# EAGLE design v2.1 Main (EAGLE 9.7.0)
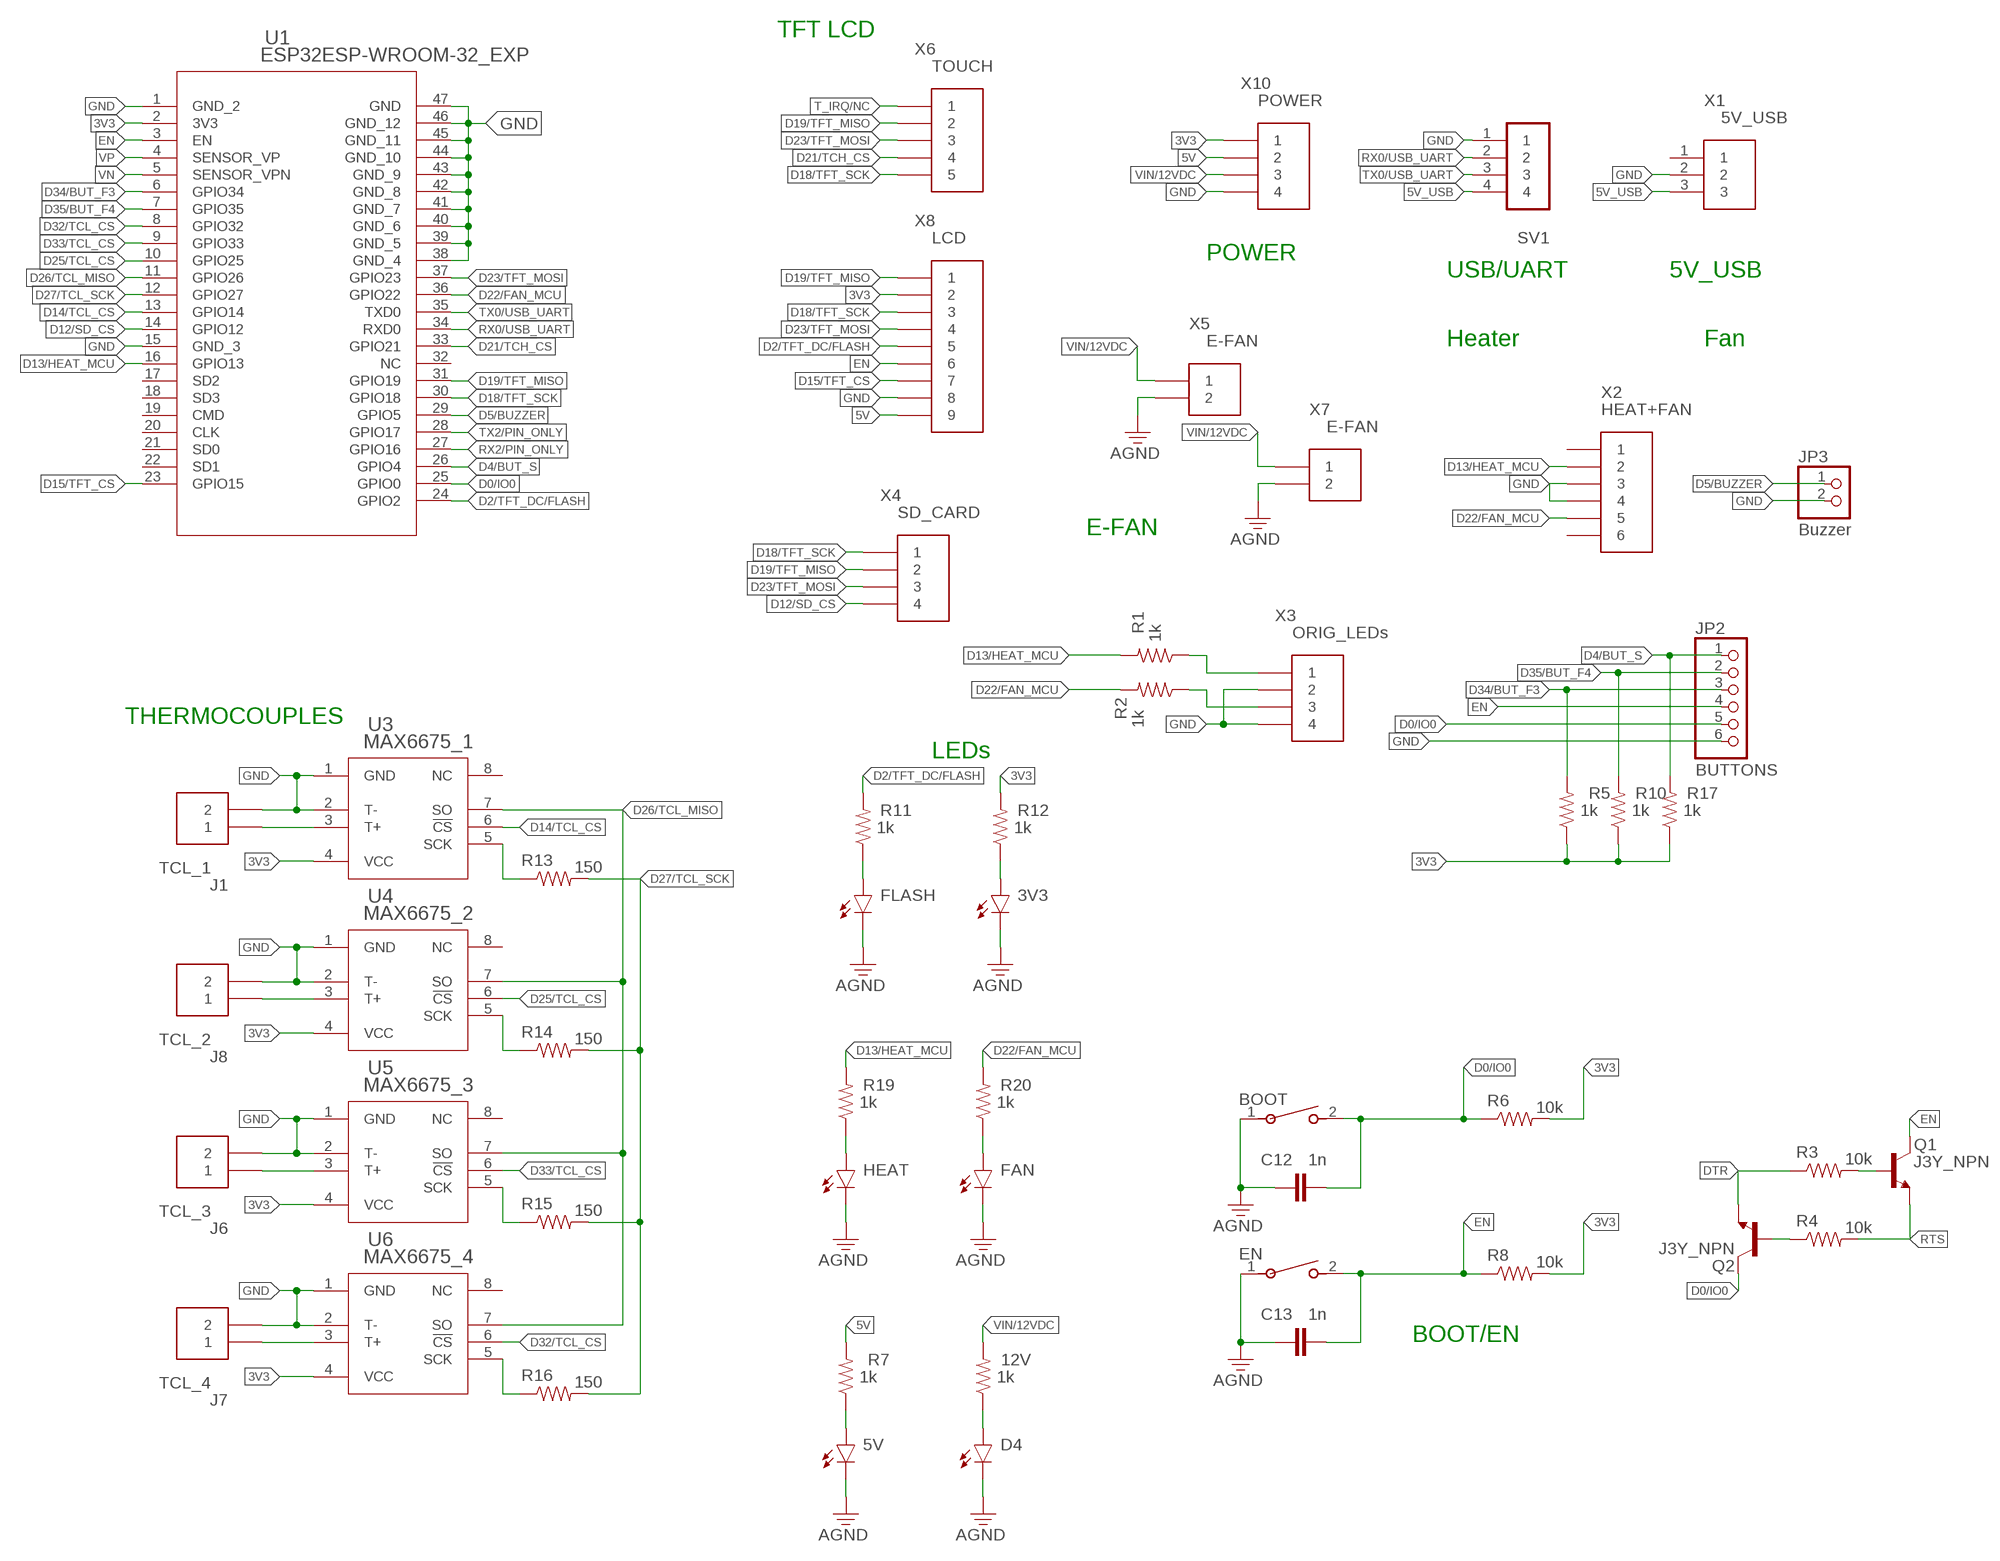
[diagram p0: schematic, sheet 1]

## Parts
3V3  LED  CHIP-FLAT-B_0805  [LEDC2012X110N_FLAT-B]
5V  LED  CHIP-FLAT-B_0805  [LEDC2012X110N_FLAT-B]
12V  1k  R-US_CHIP-0805(2012-METRIC)  [RESC2012X65]
BOOT  EVQ22705RSW_EVQ22705R_PAN  [SW_EVQ22705R_PAN]
C12  1n  C_CHIP-0805(2012-METRIC)  [CAPC2012X110]
C13  1n  C_CHIP-0805(2012-METRIC)  [CAPC2012X110]
D4  LED  CHIP-FLAT-B_0805  [LEDC2012X110N_FLAT-B]
EN  EVQ22705RSW_EVQ22705R_PAN  [SW_EVQ22705R_PAN]
FAN  LED  CHIP-FLAT-B_0805  [LEDC2012X110N_FLAT-B]
FLASH  LED  CHIP-FLAT-B_0805  [LEDC2012X110N_FLAT-B]
HEAT  LED  CHIP-FLAT-B_0805  [LEDC2012X110N_FLAT-B]
J1  TCL_1  OSTVN02A150CONN_OSTVN02A150_OST  [CONN_OSTVN02A150_OST]
J6  TCL_3  OSTVN02A150CONN_OSTVN02A150_OST  [CONN_OSTVN02A150_OST]
J7  TCL_4  OSTVN02A150CONN_OSTVN02A150_OST  [CONN_OSTVN02A150_OST]
J8  TCL_2  OSTVN02A150CONN_OSTVN02A150_OST  [CONN_OSTVN02A150_OST]
JP2  BUTTONS  PINHD-1X6  [1X06]
JP3  Buzzer  PINHD-1X2  [1X02]
Q1  J3Y_NPN  NPN_SC59-BEC  [SC59]
Q2  J3Y_NPN  NPN_SC59-BEC  [SC59]
R1  1k  R-US_CHIP-0805(2012-METRIC)  [RESC2012X65]
R2  1k  R-US_CHIP-0805(2012-METRIC)  [RESC2012X65]
R3  10k  R-US_CHIP-0805(2012-METRIC)  [RESC2012X65]
R4  10k  R-US_CHIP-0805(2012-METRIC)  [RESC2012X65]
R5  1k  R-US_CHIP-0805(2012-METRIC)  [RESC2012X65]
R6  10k  R-US_CHIP-0805(2012-METRIC)  [RESC2012X65]
R7  1k  R-US_CHIP-0805(2012-METRIC)  [RESC2012X65]
R8  10k  R-US_CHIP-0805(2012-METRIC)  [RESC2012X65]
R10  1k  R-US_CHIP-0805(2012-METRIC)  [RESC2012X65]
R11  1k  R-US_CHIP-0805(2012-METRIC)  [RESC2012X65]
R12  1k  R-US_CHIP-0805(2012-METRIC)  [RESC2012X65]
R13  150  R-US_CHIP-0805(2012-METRIC)  [RESC2012X65]
R14  150  R-US_CHIP-0805(2012-METRIC)  [RESC2012X65]
R15  150  R-US_CHIP-0805(2012-METRIC)  [RESC2012X65]
R16  150  R-US_CHIP-0805(2012-METRIC)  [RESC2012X65]
R17  1k  R-US_CHIP-0805(2012-METRIC)  [RESC2012X65]
R19  1k  R-US_CHIP-0805(2012-METRIC)  [RESC2012X65]
R20  1k  R-US_CHIP-0805(2012-METRIC)  [RESC2012X65]
SV1  FEM-HEAD  [FE05-1]
U1  ESP32ESP-WROOM-32_EXP  [ESP32_SCH_PCB]
U3  MAX6675_1  MAX6675_LARGE21-0041B_8_MXM  [21-0041B_8_MXM]
U4  MAX6675_2  MAX6675_LARGE21-0041B_8_MXM  [21-0041B_8_MXM]
U5  MAX6675_3  MAX6675_LARGE21-0041B_8_MXM  [21-0041B_8_MXM]
U6  MAX6675_4  MAX6675_LARGE21-0041B_8_MXM  [21-0041B_8_MXM]
X1  5V_USB  JST-XH-03-PIN-LONG-PAD  [JST-XH-03-PACKAGE-LONG-PAD]
X2  HEAT+FAN  JST-XH-06-PIN-LONG-PAD  [JST-XH-06-PACKAGE-LONG-PAD]
X3  ORIG_LEDs  JST-XH-04-PIN-LONG-PAD  [JST-XH-04-PACKAGE-LONG-PAD]
X4  SD_CARD  JST-XH-04-PIN-LONG-PAD  [JST-XH-04-PACKAGE-LONG-PAD]
X5  E-FAN  JST-XH-02-PIN-LONG-PAD  [-LONG-PAD]
X6  TOUCH  JST-XH-05-PIN-LONG-PAD  [JST-XH-05-PACKAGE-LONG-PAD]
X7  E-FAN  JST-XH-02-PIN-LONG-PAD  [-LONG-PAD]
X8  LCD  JST-XH-09-PIN-LONG-PAD  [JST-XH-09-PACKAGE-LONG-PAD]
X10  POWER  JST-XH-04-PIN-LONG-PAD  [JST-XH-04-PACKAGE-LONG-PAD]

## Nets
3V3: R5.1 R6.2 R8.2 R10.1 R12.2 R17.1 U1.2(3V3) U3.4(VCC) U4.4(VCC) U5.4(VCC) U6.4(VCC) X8.2 X10.1
5V: R7.2 X8.9 X10.2
5V_USB: SV1.4 X1.3
D0/IO0: BOOT.2 C12.2 JP2.5 Q2.C R6.1 U1.25(GPIO0)
D2/TFT_DC/FLASH: R11.2 U1.24(GPIO2) X8.5
D4/BUT_S: JP2.1 R17.2 U1.26(GPIO4)
D5/BUZZER: JP3.1 U1.29(GPIO5)
D12/SD_CS: U1.14(GPIO12) X4.4
D13/HEAT_MCU: R1.2 R19.2 U1.16(GPIO13) X2.2
D14/TCL_CS: U1.13(GPIO14) U3.6(!CS)
D15/TFT_CS: U1.23(GPIO15) X8.7
D18/TFT_SCK: U1.30(GPIO18) X4.1 X6.5 X8.3
D19/TFT_MISO: U1.31(GPIO19) X4.2 X6.2 X8.1
D21/TCH_CS: U1.33(GPIO21) X6.4
D22/FAN_MCU: R2.2 R20.2 U1.36(GPIO22) X2.5
D23/TFT_MOSI: U1.37(GPIO23) X4.3 X6.3 X8.4
D25/TCL_CS: U1.10(GPIO25) U4.6(!CS)
D26/TCL_MISO: U1.11(GPIO26) U3.7(SO) U4.7(SO) U5.7(SO) U6.7(SO)
D27/TCL_SCK: R13.2 R14.2 R15.2 R16.2 U1.12(GPIO27)
D32/TCL_CS: U1.8(GPIO32) U6.6(!CS)
D33/TCL_CS: U1.9(GPIO33) U5.6(!CS)
D34/BUT_F3: JP2.3 R5.2 U1.6(GPIO34)
D35/BUT_F4: JP2.2 R10.2 U1.7(GPIO35)
DTR: Q2.E R3.1
EN: C13.2 EN.2 JP2.4 Q1.C R8.1 U1.3(EN) X8.6
FAN_LED: R2.1 X3.3
GND: 3V3.C 5V.C BOOT.1 C12.1 C13.1 D4.C EN.1 FAN.C FLASH.C HEAT.C J1.2 J6.2 J7.2 J8.2 JP2.6 JP3.2 SV1.1 U1.1(GND_2) U1.15(GND_3) U1.38(GND_4) U1.39(GND_5) U1.40(GND_6) U1.41(GND_7) U1.42(GND_8) U1.43(GND_9) U1.44(GND_10) U1.45(GND_11) U1.46(GND_12) U1.47(GND) U3.1(GND) U3.2(T-) U4.1(GND) U4.2(T-) U5.1(GND) U5.2(T-) U6.1(GND) U6.2(T-) X1.2 X2.3 X2.4 X3.2 X3.4 X5.2 X7.2 X8.8 X10.4 ; supply symbol labelled AGND
HEAT_LED: R1.1 X3.1
N$1: FLASH.A R11.1
N$2: Q1.B R3.2
N$4: Q2.B R4.1
N$6: 3V3.A R12.1
N$7: 5V.A R7.1
N$8: 12V.1 D4.A
N$26: HEAT.A R19.1
N$27: FAN.A R20.1
RTS: Q1.E R4.2
RX0/USB_UART: SV1.2 U1.34(RXD0)
RX2/PIN_ONLY: U1.27(GPIO16)
T1: J1.1 U3.3(T+)
T2: J8.1 U4.3(T+)
T3: J6.1 U5.3(T+)
T4: J7.1 U6.3(T+)
T_IRQ/NC: X6.1
TCL_SCK1: R13.1 U3.5(SCK)
TCL_SCK2: R14.1 U4.5(SCK)
TCL_SCK3: R15.1 U5.5(SCK)
TCL_SCK4: R16.1 U6.5(SCK)
TX0/USB_UART: SV1.3 U1.35(TXD0)
TX2/PIN_ONLY: U1.28(GPIO17)
VIN/12VDC: 12V.2 X5.1 X7.1 X10.3
VN: U1.5(SENSOR_VPN)
VP: U1.4(SENSOR_VP)
Unconnected: U1.17(SD2) U1.18(SD3) U1.19(CMD) U1.20(CLK) U1.21(SD0) U1.22(SD1) U1.32(NC) U3.8(NC) U4.8(NC) U5.8(NC) U6.8(NC) X1.1 X2.1 X2.6

## Notes on the sheet
- TFT LCD
- POWER
- USB/UART | 5V_USB
- Heater | Fan
- E-FAN
- THERMOCOUPLES
- LEDs
- BOOT/EN

## Library data of the parts
3V3 5V D4 FAN FLASH HEAT = LED:CHIP-FLAT-B: Blue LED - Generic; CATEGORY: LED; COLOR: Blue; DESCRIPTION: Blue LED Indication 0805 (2012 Metric); PACKAGE_SIZE: 0805; PACKAGE_TYPE: SMD; SUBCATEGORY: Chip LED; TYPE: Square with Flat Top
12V R1-R8 R10-R17 R19 R20 = Resistor:R-US: Resistor Fixed - ANSI; CATEGORY: Resistors; DESCRIPTION: Chip Resistor 2.00 X 1.25 X 0.65 mm body 0805(2012-METRIC) Package; PACKAGE_SIZE: 0805; PACKAGE_TYPE: SMD
BOOT EN = SD-SolderSync-Library:EVQ22705R; COPYRIGHT: Copyright (C) 2024 Ultra Librarian. All rights reserved.; MANUFACTURER_PART_NUMBER: EVQ-22705R; MFR_NAME: Panasonic
C12 C13 = Capacitor:C: Capacitor - Generic; CATEGORY: Capacitor; PACKAGE_SIZE: 0805; PACKAGE_TYPE: SMD; SUBCATEGORY: Ceramic Capacitors; TYPE: MLCC
J1 J6-J8 = Connectors:OSTVN02A150; COPYRIGHT: Copyright (C) 2025 Ultra Librarian. All rights reserved.; MANUFACTURER_PART_NUMBER: OSTVN02A150; MFR_NAME: On Shore Technology
JP2 = Connector:PINHD-1X6: PIN HEADER; CATEGORY: Headers; DESCRIPTION: Header-Straight-6 Position; PACKAGE_TYPE: THT; PITCH: 0.100" (2.54mm); SUBCATEGORY: Headers-Male Pins; TYPE: Board to Board or Cable-Unshrouded-Through Hole-Straight
JP3 = Connector:PINHD-1X2: PIN HEADER; CATEGORY: Headers; DESCRIPTION: Header-Straight-2 Position; PACKAGE_TYPE: THT; PITCH: 0.100" (2.54mm); SUBCATEGORY: Headers-Male Pins; TYPE: Board to Board or Cable-Unshrouded-Through Hole-Straight
Q1 Q2 = Transistor:NPN: NPN - Generic; CATEGORY: Transistor; SUB-CATEGORY: BJT; TYPE: NPN; VALUE: NPN
SV1 = Connectors:FEM-HEAD: FEMALE HEADER; OC_FARNELL: unknown; OC_NEWARK: unknown
U1 = SD-SolderSync-Library:ESP32; COPYRIGHT: Copyright (C) 2024 Ultra Librarian. All rights reserved.; MANUFACTURER_PART_NUMBER: ESP-WROOM-32; MFR_NAME: Espressif Systems
U3-U6 = SD-SolderSync-Library:MAX6675_LARGE; COPYRIGHT: Copyright (C) 2025 Ultra Librarian. All rights reserved.; MANUFACTURER_PART_NUMBER: max6675isa+T; MFR_NAME: Analog Devices Inc
X1 = Connectors:JST-XH-03-PIN: JST XH Connector 2 Pin Wire to board connector. Pitch: 2,54 mm, (0.100") Number of pins: 3 Created by Rembrandt Electronics www.rembrandtelectronics.com
X2 = Connectors:JST-XH-06-PIN: JST XH Connector 2 Pin Wire to board connector. Pitch: 2,54 mm, (0.100") Number of pins: 6 Created by Rembrandt Electronics www.rembrandtelectronics.com
X3 X4 X10 = Connectors:JST-XH-04-PIN: JST XH Connector 2 Pin Wire to board connector. Pitch: 2,54 mm, (0.100") Number of pins: 4 Created by Rembrandt Electronics www.rembrandtelectronics.com
X5 X7 = Connectors:JST-XH-02-PIN: JST XH Connector 2 Pin Wire to board connector. Pitch: 2,54 mm, (0.100") Number of pins: 2 Created by Rembrandt Electronics www.rembrandtelectronics.com
X6 = Connectors:JST-XH-05-PIN: JST XH Connector 2 Pin Wire to board connector. Pitch: 2,54 mm, (0.100") Number of pins: 5 Created by Rembrandt Electronics www.rembrandtelectronics.com
X8 = Connectors:JST-XH-09-PIN: JST XH Connector 2 Pin Wire to board connector. Pitch: 2,54 mm, (0.100") Number of pins: 9 Created by Rembrandt Electronics www.rembrandtelectronics.com

## Board
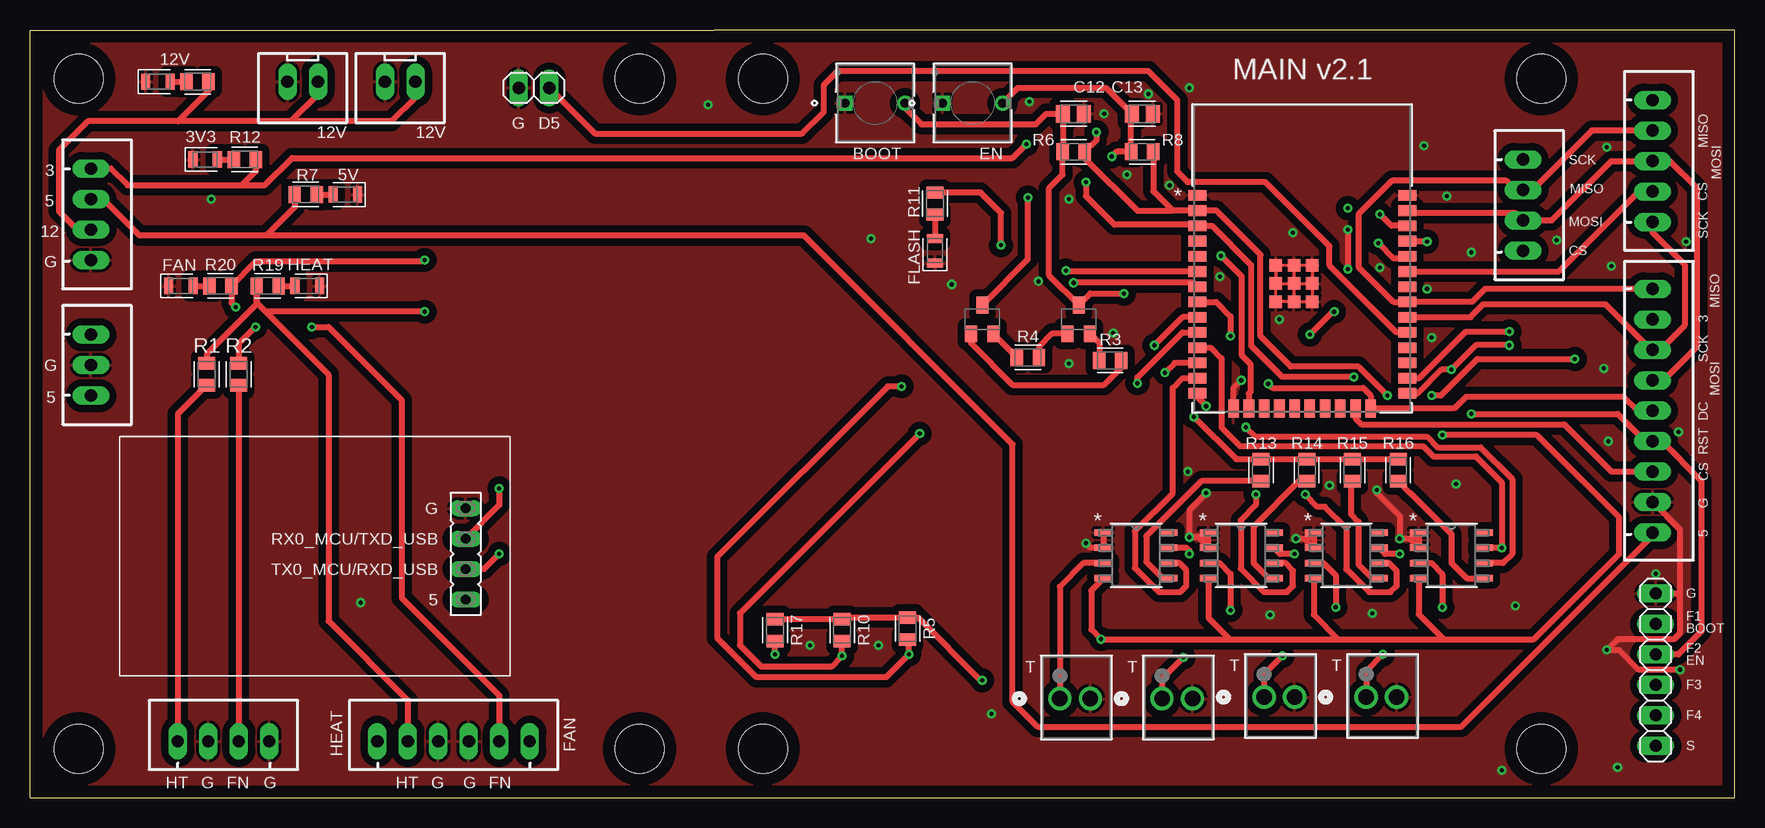
[diagram p1: board, top side]
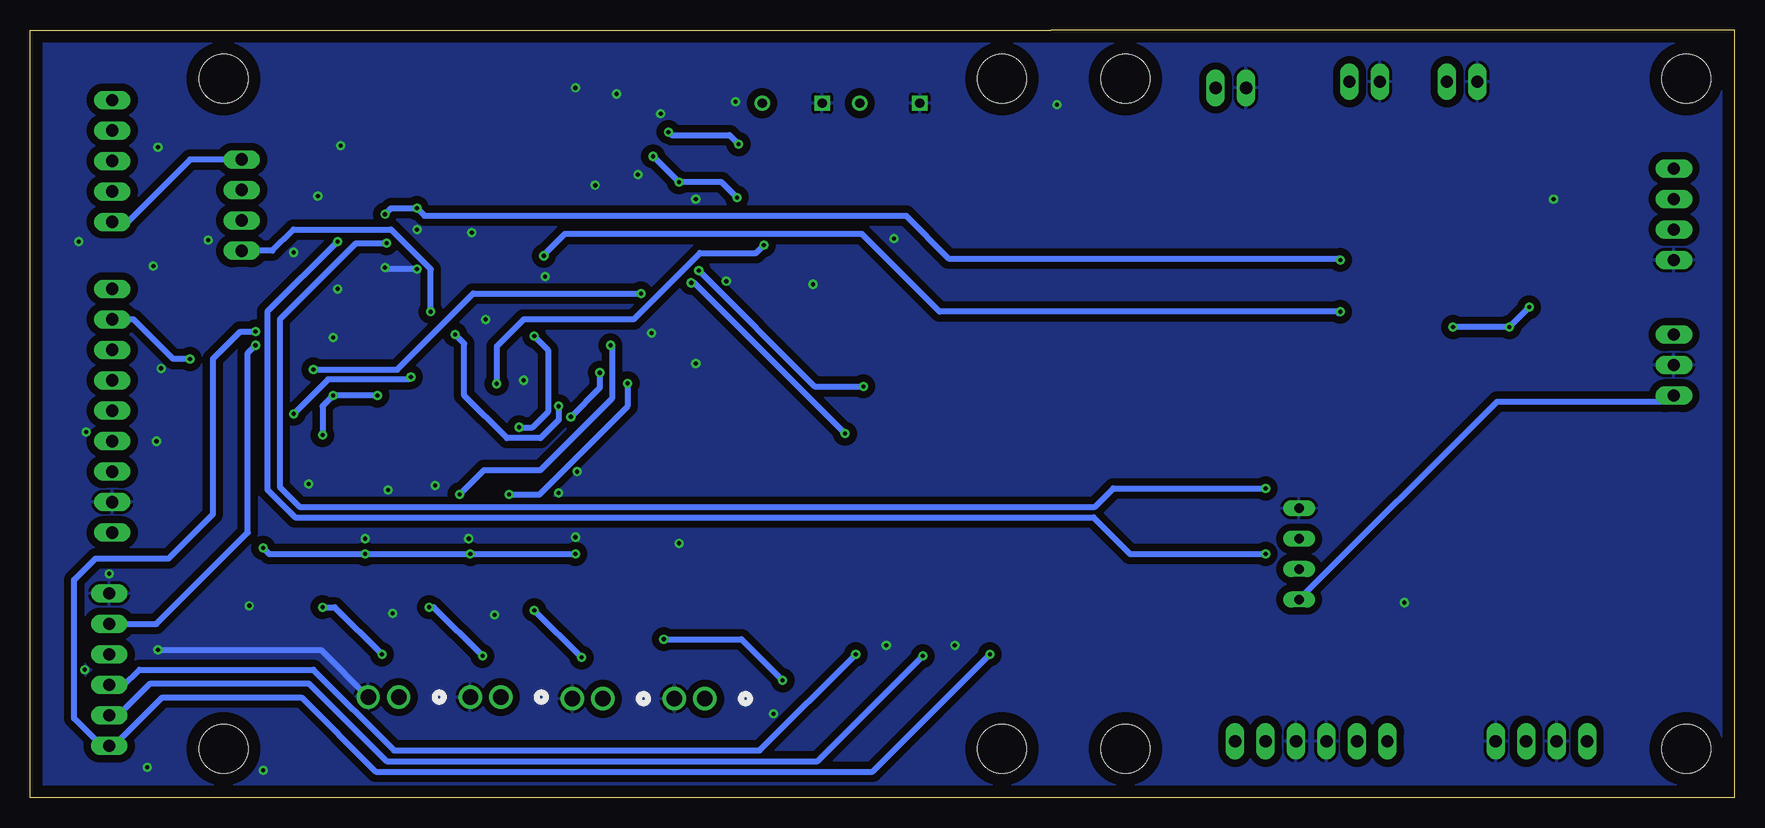
[diagram p2: board, bottom side, seen from below]

Size 142.11 x 64.01 mm. Coordinates in mm from the lower left corner, seen from the top.
Outline: 0,0 142.11,0 142.11,64.01 57.02,64.01 0,64.01 0,0
Copper layers (1*16): Top 0.035mm / dielectric 1.5mm / Bottom 0.035mm
Design rules "Fusion Electronics Design Rules": minimum track width 6mil, minimum drill 0.35mm, track to track 6mil, track to pad 6mil, pad to pad 6mil, via to via 6mil, smd to smd 6mil, copper to edge 40mil, drill to drill 6mil, minimum pad ring 10mil, minimum via ring 8mil, stop-mask expansion 4mil, vias tented up to drill 0mil, thermal gap 10mil
Holes 4.06 mm at 61.09,4.06 125.98,4.06 125.98,59.94 61.09,59.94 4.06,4.06 4.06,59.94 50.8,59.94 50.8,4.06

### Footprints (pad centres in the part's own frame; a part is rotated, then mirrored left to right if it is on the bottom)
LEDC2012X110N_FLAT-B = smd 0.762 x 1.362: A 1.025,0; C -1.025,0
RESC2012X65 = smd 1.031 x 1.42: 1 -0.919,0; 2 0.919,0
SW_EVQ22705R_PAN = drill 0.762 pad 1.27 square: 1 0,0 | drill 0.762 pad 1.27: 2 5.004,0
CAPC2012X110 = smd 1.165 x 1.465: 1 -0.875,0; 2 0.875,0
CONN_OSTVN02A150_OST = drill 1.295 pad 1.803: 1 0,0; 2 2.54,0
1X06 = drill 1.016 long: 1 -6.35,0; 2 -3.81,0; 3 -1.27,0; 4 1.27,0; 5 3.81,0; 6 6.35,0
1X02 = drill 1.016 long: 1 -1.27,0; 2 1.27,0
SC59 = smd 1 x 1.4: B -0.95,-1.2; C 0,1.2; E 0.95,-1.2
FE05-1 = drill 0.813 long: 1 -5.08,0; 2 -2.54,0; 3 0,0; 4 2.54,0
ESP32_SCH_PCB = smd 1.499 x 0.889: 1 -8.75,5.26; 2 -8.75,3.99; 3 -8.75,2.72; 4 -8.75,1.45; 5 -8.75,0.18; 6 -8.75,-1.09; 7 -8.75,-2.36; 8 -8.75,-3.63; 9 -8.75,-4.9; 10 -8.75,-6.17; 11 -8.75,-7.44; 12 -8.75,-8.71; 13 -8.75,-9.98; 14 -8.75,-11.25; 25 8.75,-11.25; 26 8.75,-9.98; 27 8.75,-8.71; 28 8.75,-7.44; 29 8.75,-6.17; 30 8.75,-4.9; 31 8.75,-3.63; 32 8.75,-2.36; 33 8.75,-1.09; 34 8.75,0.18; 35 8.75,1.45; 36 8.75,2.72; 37 8.75,3.99; 38 8.75,5.26 | smd 0.889 x 1.499: 15 -5.715,-12.501; 16 -4.445,-12.501; 17 -3.175,-12.501; 18 -1.905,-12.501; 19 -0.635,-12.501; 20 0.635,-12.501; 21 1.905,-12.501; 22 3.175,-12.501; 23 4.445,-12.501; 24 5.715,-12.501 | smd 1.041 x 1.041: 39 -0.681,-2.08; 40 -2.205,-0.556; 41 -2.205,-2.08; 42 -2.205,-3.604; 43 -0.681,-3.604; 44 0.843,-3.604; 45 0.843,-2.08; 46 0.843,-0.556; 47 -0.681,-0.556
21-0041B_8_MXM = smd 1.46 x 0.533: 1 -2.724,1.905; 2 -2.724,0.635; 3 -2.724,-0.635; 4 -2.724,-1.905; 5 2.724,-1.905; 6 2.724,-0.635; 7 2.724,0.635; 8 2.724,1.905
JST-XH-03-PACKAGE-LONG-PAD = drill 1.016 long: 1 -2.54,0; 2 0,0; 3 2.54,0
JST-XH-06-PACKAGE-LONG-PAD = drill 1.016 long: 1 -6.35,0; 2 -3.81,0; 3 -1.27,0; 4 1.27,0; 5 3.81,0; 6 6.35,0
JST-XH-04-PACKAGE-LONG-PAD = drill 1.016 long: 1 -3.81,0; 2 -1.27,0; 3 1.27,0; 4 3.81,0
-LONG-PAD = drill 1.016 long: 1 -1.27,0; 2 1.27,0
JST-XH-05-PACKAGE-LONG-PAD = drill 1.016 long: 1 -5.08,0; 2 -2.54,0; 3 0,0; 4 2.54,0; 5 5.08,0
JST-XH-09-PACKAGE-LONG-PAD = drill 1.016 long: 1 -10.16,0; 2 -7.62,0; 3 -5.08,0; 4 -2.54,0; 5 0,0; 6 2.54,0; 7 5.08,0; 8 7.62,0; 9 10.16,0

### Placement (x,y rotation side)
3V3  14.61,53.21 0 top
5V  26.29,50.29 180 top
12V  13.97,59.69 0 top
BOOT  67.95,57.91 0 top
C12  87,57.02 180 top
C13  92.71,57.02 180 top
D4  10.67,59.69 0 top
EN  76.07,57.91 0 top
FAN  12.57,42.67 0 top
FLASH  75.44,45.59 90 top
HEAT  23.11,42.67 180 top
J1  85.85,8.26 0 top
J6  102.87,8.38 0 top
J7  111.38,8.38 0 top
J8  94.36,8.26 0 top
JP2  135.51,10.67 90 top
JP3  42.01,59.18 180 top
Q1  79.38,39.88 0 top
Q2  87.42,39.88 0 top
R1  14.73,35.31 90 top
R2  17.4,35.31 90 top
R3  90.04,36.45 0 top
R4  83.19,36.7 180 top
R5  73.15,14.1 270 top
R6  87,53.85 0 top
R7  22.99,50.29 180 top
R8  92.71,53.85 0 top
R10  67.69,13.97 270 top
R11  75.44,49.53 90 top
R12  17.91,53.21 0 top
R13  102.62,27.3 90 top
R14  106.43,27.3 90 top
R15  110.24,27.3 90 top
R16  114.05,27.3 90 top
R17  62.1,13.97 270 top
R19  19.81,42.67 180 top
R20  15.88,42.67 0 top
SV1  36.32,19.05 270 top
U1  106.05,44.96 0 top
U3  92.2,20.19 0 top
U4  100.97,20.19 0 top
U5  109.73,20.19 0 top
U6  118.49,20.19 0 top
X1  5.08,36.07 270 top
X2  35.31,4.7 0 top
X3  16.13,4.7 0 top
X4  124.46,49.4 270 top
X5  30.86,59.69 180 top
X6  135.25,53.09 270 top
X7  22.73,59.69 180 top
X8  135.25,32.26 270 top
X10  5.08,48.64 270 top

### Tracks (layer width: path | path; a pad name or v marks a point on that pad's centre or on a via)
3V3  (via drill 0.35)
  Top 0.254: 96.97,48.95 U1.2
  Top 0.508: v128.78,36.58 120.65,36.58 117.6,33.53 v116.84,33.53 | v113.16,33.53 110.74,35.94 105.1,35.94 102.56,38.47 102.56,45.26 98.88,48.95 U1.2 95.25,48.95 | R8.2 93.63,50.57 95.25,48.95 | U3.4 88.47,17.28 88.47,14.02 v89.28,13.21 100.02,13.21 | v117.73,30.23 125.6,30.23 132.46,23.37 132.46,20.32 125.35,13.21 117.86,13.21 | X10.1 6.73,52.45 8.13,51.05 17.65,51.05 | v88.9,55.5 88.9,54.83 R6.2 87.92,53.34 92.33,48.92 95.23,48.92 95.25,48.95 | R17.1 R10.1 67.82,15.02 R5.1 74.01,15.02 79.25,9.78 v79.38,9.78 | v83.06,54.48 81.92,53.34 21.84,53.34 19.56,51.05 17.65,51.05 | R12.2 18.83,52.23 17.65,51.05 | 100.02,13.21 109.04,13.21 | 109.04,13.21 117.86,13.21 | 100.02,13.21 98.24,14.99 U4.4 | 109.04,13.21 107,15.24 U5.4 | U6.4 115.77,15.3 117.86,13.21
  Bottom 0.508: v113.16,33.53 v116.84,33.53 117.73,32.64 v117.73,30.23 | v88.9,55.5 88.65,55.24 83.82,55.24 v83.06,54.48 | v89.28,13.21 82.8,13.21 v79.38,9.78 | X8.2 133.48,39.88 130.18,36.58 v128.78,36.58
5V
  Top 0.508: X8.9 135.25,21.84 119.33,5.92 84,5.92 81.92,8 81.92,29.46 64.52,46.86 19.69,46.86 | 19.69,46.86 9.14,46.86 6.1,49.91 X10.2 | 22.1,50.26 R7.2 22.07,49.24 19.69,46.86
5V_USB
  Bottom 0.508: SV1.4 19.81,33.02 5.59,33.02 X1.3
D0/IO0  (via drill 0.35)
  Top 0.508: BOOT.2 72.95,57.48 74.3,56.13 83.83,56.13 84.72,57.02 C12.2 86.12,53.89 R6.1 86.08,51.94 84.95,50.81 84.95,43.55 Q2.C 88.38,42.04 v91.19,42.04 | U1.25 115.68,33.71 117.66,35.69 v118.49,35.69 120.52,37.72 v123.32,37.72
  Bottom 0.508: v118.49,35.69 111.51,35.69 105.16,42.04 v91.19,42.04 | JP2.5 131.57,14.48 123.95,22.1 123.95,37.08 v123.32,37.72
D2/TFT_DC/FLASH  (via drill 0.35)
  Top 0.254: 111.76,32.89 U1.24
  Top 0.508: v103.22,34.51 103.56,34.16 111.12,34.16 111.76,33.53 111.76,32.89 | v80.94,46.06 80.94,48.76 79.25,50.45 R11.2 | X8.5 134.03,32.26 132.86,33.42 119.69,33.42 118.72,32.46 U1.24
  Bottom 0.508: v80.94,46.06 81.58,45.42 86.28,45.42 91.82,39.88 100.97,39.88 103.22,37.63 v103.22,34.51
D4/BUT_S  (via drill 0.35)
  Top 0.508: U1.26 115.81,34.98 119.69,38.86 v123.32,38.86 | v62.1,11.94 R17.2
  Bottom 0.508: v123.32,38.86 124.59,38.86 126.87,36.58 126.87,23.62 130.56,19.94 136.65,19.94 138.43,18.16 138.43,6.6 136.14,4.32 JP2.1 135.13,4.32 131.09,8.36 119.48,8.36 113.28,2.16 71.88,2.16 v62.1,11.94
D5/BUZZER
  Top 0.508: U1.29 113.91,38.79 108.33,44.36 108.33,45.97 103,51.31 96.52,51.31 95.63,52.2 95.63,58.17 93.22,60.58 67.31,60.58 66.17,59.44 66.17,57.17 64.37,55.37 47.09,55.37 JP3.1
D12/SD_CS  (via drill 0.35)
  Top 0.508: v98.04,32.64 97.3,33.39 U1.14 | v106.68,38.61 108.59,40.51 v108.71,40.51
  Bottom 0.508: v98.04,32.64 98.04,31.5 99.57,29.97 102.36,29.97 105.92,33.53 105.92,37.85 v106.68,38.61 | v108.71,40.51 108.71,44.07 112.01,47.37 120.14,47.37 121.92,45.59 X4.4
D13/HEAT_MCU  (via drill 0.35)
  Top 0.508: v99.28,45.18 100.99,43.47 100.99,36.91 101.75,36.15 101.75,33.84 101.6,33.69 U1.16 | v32.89,40.51 19.66,40.51 | 19.66,40.51 18.89,41.27 R19.2 18.89,41.15 14.73,36.99 R1.2 | 19.66,40.51 24.89,35.28 24.89,14.73 31.5,8.13 X2.2
  Bottom 0.508: v99.28,45.18 99.28,45.24 97.54,46.99 72.77,46.99 66.29,40.51 v32.89,40.51 33.02,40.39
D14/TCL_CS
  Top 0.508: U1.13 96.06,34.98 95.25,34.16 95.25,25.37 92.1,22.22 92.1,19.15 94.11,17.14 95.89,17.14 96.39,17.65 96.39,18.98 95.81,19.56 U3.6
D15/TFT_CS
  Top 0.508: U1.23 110.49,31.62 111,31.11 127.89,31.11 131.83,27.18 X8.7
D18/TFT_SCK
  Top 0.254: 135.25,37.64 X8.3
  Top 0.508: 115.05,40.31 U1.30 120.07,40.06 121.16,41.15 131.32,41.15 135.13,37.34 X8.3 135.89,37.34 137.92,39.37 137.92,44.45 135.25,47.12 X6.5
  Bottom 0.508: X4.1 128.78,53.21 133.99,48.01 X6.5
D19/TFT_MISO
  Top 0.508: X8.1 121.28,42.42 120.19,41.33 U1.31 113.67,41.33 110.74,44.25 110.74,48.64 113.54,51.44 123.06,51.44 123.83,50.67 X4.2 125.22,50.67 130.18,55.63 X6.2
D21/TCH_CS
  Top 0.508: U1.33 127.43,43.87 134.11,50.55 X6.4
D22/FAN_MCU  (via drill 0.35)
  Top 0.508: U1.36 113.49,47.68 v112.52,48.64 | v32.89,44.83 32.89,44.7 18.83,44.7 R20.2 16.8,41.24 v17.15,40.89 | v18.8,39.24 18.77,39.24 17.4,37.88 R2.2 | v23.5,39.24 24.89,39.24 30.99,33.15 30.99,16.64 39.12,8.51 X2.5
  Bottom 0.508: v112.52,48.64 112.01,49.15 v109.86,49.15 109.22,48.51 69.09,48.51 65.53,44.96 33.02,44.96 v32.89,44.83 | v17.15,40.89 v18.8,39.24 v23.5,39.24
D23/TFT_MOSI
  Top 0.508: X8.4 136.14,34.8 138.96,37.62 138.96,50.8 136.68,53.09 X6.3 131.83,53.09 126.87,48.13 X4.3 123.86,48.73 115.01,48.73 U1.37
D25/TCL_CS  (via drill 0.35)
  Top 0.508: U1.10 96.06,38.79 92.31,35.03 v92.31,34.54 | v102.19,25.27 102.19,24.38 100.92,23.11 100.92,19.1 102.87,17.14 104.78,17.14 105.28,17.65 105.28,18.92 104.65,19.56 U4.6
  Bottom 0.508: v92.31,34.54 92.31,32.62 99.65,25.27 v102.19,25.27
D26/TCL_MISO  (via drill 0.35)
  Top 0.508: U1.11 98.43,37.52 99.31,36.63 99.31,30.86 100.86,29.31 116.1,29.31 116.97,28.45 120.52,28.45 122.68,26.29 v122.68,20.83 U6.7 | v96.65,20.32 96.65,20.57 96.39,20.83 U3.7 | v114.17,20.32 112.96,20.32 U5.7 | v105.41,20.32 104.2,20.32 U4.7
  Bottom 0.508: v96.65,20.32 v105.41,20.32 v114.17,20.32 122.17,20.32 v122.68,20.83
D27/TCL_SCK  (via drill 0.35)
  Top 0.508: R16.2 R15.2 R14.2 R13.2 100.55,28.22 v97.03,31.75 | U1.12 95.43,36.25 v94.62,35.43
  Bottom 0.508: v97.03,31.75 94.62,34.16 v94.62,35.43
D32/TCL_CS  (via drill 0.35)
  Top 0.508: U1.8 98.88,41.33 100.08,40.13 v100.08,38.48 | v101.35,30.88 102.13,30.1 116.46,30.1 117.35,29.21 120.9,29.21 123.55,26.57 123.55,20.32 122.78,19.56 U6.6
  Bottom 0.508: v101.35,30.88 100.2,30.88 98.93,32.15 98.93,37.34 v100.08,38.48
D33/TCL_CS  (via drill 0.35)
  Top 0.508: U1.9 96.06,40.06 v93.73,37.72 | v106.3,25.27 107.31,24.26 107.95,24.26 109.73,22.48 109.73,19.06 111.64,17.14 113.41,17.14 113.92,17.65 113.92,18.92 113.28,19.56 U5.6
  Bottom 0.508: v93.73,37.72 93.6,37.59 93.6,33.27 99.57,27.3 104.27,27.3 v106.3,25.27
D34/BUT_F3  (via drill 0.35)
  Top 0.508: R5.2 73.28,13.05 v73.28,11.94 71.37,10.03 60.58,10.03 57.28,13.34 57.28,20.07 71.5,34.29 v72.64,34.29 | U1.6 86.43,43.87 v86.36,43.94
  Bottom 0.508: JP2.3 135.38,9.27 134.37,9.27 132.97,10.67 118.49,10.67 111.76,3.94 81.28,3.94 v73.28,11.94 | v86.36,43.94 76.71,34.29 v72.64,34.29
D35/BUT_F4  (via drill 0.35)
  Top 0.508: 97.81,42.6 U1.7 96.97,42.93 v87,42.93 | 67.72,13.08 R10.2 v67.69,11.81 66.8,10.92 60.96,10.92 59.18,12.7 59.18,15.37 v74.17,30.35
  Bottom 0.508: JP2.2 134.75,6.86 132.08,9.53 118.87,9.53 112.4,3.05 76.45,3.05 v67.69,11.81 | v87,42.93 86.74,42.93 v74.17,30.35
DTR
  Top 0.508: Q2.E 89.13,37.92 R3.1
EN  (via drill 0.35)
  Top 0.254: R8.1 92.08,53.56
  Top 0.508: v120.14,32 132.33,32 134.62,29.72 X8.6 136.02,29.72 139.32,26.42 139.32,13.84 137.41,11.94 JP2.4 | v110.36,35.08 104.39,35.08 101.78,37.69 101.78,44.42 98.52,47.68 U1.3 97.21,47.77 90.41,47.77 88.01,50.16 v88.01,51.31 | EN.2 82.35,59.18 89.68,59.18 C13.2 91.79,56.98 R8.1 90.55,53.85 v90.17,53.47 | Q1.C 83.19,44.89 v83.19,50.04
  Bottom 0.508: v83.19,50.04 84.45,51.31 v88.01,51.31 v90.17,53.47 | v110.36,35.08 110.56,34.87 117.27,34.87 v120.14,32 | JP2.4 135.38,11.81
FAN_LED
  Top 0.508: R2.1 X3.3
GND  (via drill 0.35)
  Top 0.254: U1.40 U1.47 | U1.47 U1.46 U1.45 | U1.45 U1.44 U1.43 | U1.47 U1.39 | U1.40 U1.41 | U1.43 U1.42 | U1.42 U1.41 | U1.39 U1.43 | U1.41 U1.39 | U1.39 U1.45 | U1.40 103.84,44.62 | U1.42 104.14,41.05
  Top 0.508: v100.97,34.8 100.33,34.16 U1.15 | U3.1 U3.2 88.39,20.83 v88.01,21.21 | v114.17,21.59 115.26,21.59 U6.1 U6.2 115,21.59 v114.17,21.59 | v96.65,21.72 97.86,21.72 U4.1 U4.2 97.35,21.72 v96.65,21.72 | v109.86,47.37 v109.86,44.07 | X8.8 137.54,22.35 137.54,16.76 | 137.54,16.76 137.54,13.72 137.03,13.21 132.33,13.21 v131.44,12.32 132.46,12.32 134.11,10.67 v137.54,10.67 | JP2.6 137.29,17.02 137.54,16.76 | v98.04,25.4 96.65,24 v96.65,21.72 | v112.27,25.65 112.27,25.4 114.17,23.5 v114.17,21.59 | U5.1 U5.2 106.24,21.59 v105.54,21.59 106.5,21.59 U5.1
  Bottom 0.508: v109.86,44.07 112.4,44.07 v112.52,44.2 | v131.44,12.32 117.86,12.32 J7.2
  other vias: 96.65,59.18 118.11,50.16 95,51.05 89.53,57.02 104.14,39.88 91.44,51.94 27.56,16.26 65.02,12.7 70.74,12.7 80.14,6.99 118.87,26.16 116.84,38.35 105.28,47.12 99.19,43.43 84.07,43.05 56.52,57.78 132.33,2.54 122.68,2.29 70.1,46.61 96.52,27.18 116.21,54.36 127.25,46.48 108.33,26.04 76.84,42.8 15.11,49.91 86.61,49.91 135.51,18.67 137.41,30.48 93.22,58.67 131.19,35.79 123.83,16 111.89,15.37 103.38,15.24 86.61,36.2 90.3,38.73 83.31,58.04 131.44,54.23 131.83,44.32 116.46,42.42 120.14,45.47 138.05,46.35 131.57,29.72
  pour Top (isolate 0.61): -1.45,-1.19 143.69,-1.19 143.69,65.33 -1.45,65.33
  pour Bottom (isolate 0.61): -2.08,-2.46 145.08,-2.46 145.08,66.6 -2.08,66.6
HEAT_LED
  Top 0.508: R1.1 12.32,31.97 X3.1
N$1
  Top 0.508: R11.1 FLASH.A
N$2
  Top 0.508: 78.43,38.93 Q1.B 78.43,37.91 81.92,34.42 89.53,34.42 90.96,35.84 R3.2 91.09,36.58
N$4
  Top 0.508: Q2.B 85.2,38.68 84.1,37.58 R4.1
N$6
  Top 0.508: 3V3.A R12.1
N$7
  Top 0.508: R7.1 5V.A
N$8
  Top 0.508: D4.A 12V.1
N$26
  Top 0.508: R19.1 HEAT.A
N$27
  Top 0.508: FAN.A R20.1 14.98,42.67
RTS
  Top 0.254: Q1.E 80.65,38.36
  Top 0.508: R4.2 80.33,38.64 Q1.E
RX0/USB_UART  (via drill 0.35)
  Top 0.508: U1.34 114.62,44.96 113.67,44.96 v112.4,46.23 | v39.12,25.78 39.12,24.38 SV1.2
  Bottom 0.508: v112.4,46.23 114.94,46.23 121.28,39.88 121.28,25.91 119.63,24.26 53.34,24.26 51.82,25.78 v39.12,25.78
T1
  Top 0.508: U3.3 87.83,19.56 85.85,17.58 J1.1
T2  (via drill 0.35)
  Top 0.508: U4.3 99.19,19.56 100.08,18.67 v100.08,15.62 | v96.14,11.68 94.36,9.91 J8.1
  Bottom 0.508: v100.08,15.62 v96.14,11.68
T3  (via drill 0.35)
  Top 0.508: U5.3 107.82,19.56 108.84,18.54 v108.84,15.88 | v104.39,11.81 102.87,10.29 J6.1
  Bottom 0.508: v108.84,15.88 108.46,15.88 v104.39,11.81
T4  (via drill 0.35)
  Top 0.508: U6.3 116.84,19.56 117.73,18.67 v117.73,15.88 | v112.78,11.94 111.38,10.54 J7.1
  Bottom 0.508: v117.73,15.88 116.71,15.88 v112.78,11.94
TCL_SCK1
  Top 0.508: R13.1 97.63,26.39 93.05,21.8 93.05,19.66 94.42,18.29 U3.5
TCL_SCK2
  Top 0.508: R14.1 105.79,26.39 101.98,22.58 101.98,19.56 103.25,18.29 U4.5
TCL_SCK3
  Top 0.508: R15.1 110.11,26.26 110.11,23.64 110.74,23.01 110.74,19.43 111.89,18.29 U5.5
TCL_SCK4
  Top 0.508: R16.1 115.06,25.37 115.09,25.37 118.49,21.97 118.49,19.56 119.76,18.29 U6.5
TX0/USB_UART  (via drill 0.35)
  Top 0.508: U1.35 116.41,46.41 v116.46,46.35 | v39.12,20.32 37.85,19.05 SV1.3
  Bottom 0.508: v116.46,46.35 116.48,46.35 122.33,40.51 122.33,25.68 120.02,23.37 53.47,23.37 50.42,20.32 v39.12,20.32
VIN/12VDC
  Top 0.508: X5.1 32.13,58.42 30.1,56.39 21.72,56.39 | 21.72,56.39 12.35,56.39 | 12.35,56.39 4.83,56.39 2.41,53.98 2.41,48.9 3.94,47.37 X10.3 | 12V.2 14.89,58.93 12.35,56.39 | X7.1 24,58.67 21.72,56.39

### Text on the board
tPlace: MAIN v2.1 | G | D5 | MISO | 12V | 12V | SCK | 3 | MOSI | MISO | 5 | CS | SCK | 12 | MOSI | G | CS | MISO | 3 | SCK | G | 5 | MOSI | DC | RST | CS | G | G | RX0_MCU/TXD_USB | 5 | TX0_MCU/RXD_USB | 5 | G | F1 | BOOT | T | T | F2 | T | T | EN | F3 | F4 | FAN | S | HEAT | HT | G | FN | G | HT | G | G | FN